# EAGLE design ADJ POS (EAGLE 6.4)
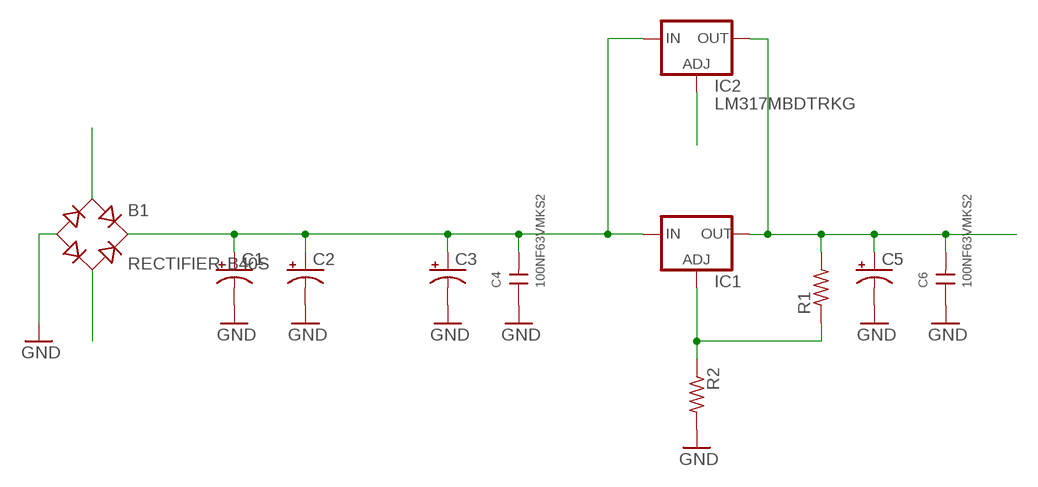
[diagram p0: schematic, sheet 1]

## Parts
B1  RECTIFIER-B40S  [B40S]
C1  CPOL-USE7.5-16  [E7,5-16]
C2  CPOL-USE7.5-16  [E7,5-16]
C3  CPOL-USE2-5  [E2-5]
C4  100NF63VMKS2  [2,5X6,5RM5,0]
C5  CPOL-USE2-5  [E2-5]
C6  100NF63VMKS2  [2,5X6,5RM5,0]
IC1  LM317TS  [317TS]
IC2  LM317MBDTRKG  [DPACK]
R1  R-US_0309/12  [0309/12]
R2  R-US_0309/12  [0309/12]

## Nets
AC_1: B1.AC1
AC_2: B1.AC2
ADJ: IC1.1(ADJ) IC2.1(ADJ) R1.1 R2.1
GND: B1.- C1.- C2.- C3.- C4.1 C5.- C6.1 R2.2
IN: B1.+ C1.+ C2.+ C3.+ C4.2 IC1.3(IN) IC2.3(IN)
OUT: C5.+ C6.2 IC1.2(OUT) IC2.4(OUT) R1.2

## Library data of the parts
B1 = rectifier:RECTIFIER-: Rectifier
C1-C3 C5 = rcl:CPOL-US: POLARIZED CAPACITOR, American symbol
C4 C6 = wima_c:100NF63V
IC1 = v-reg-2:LM317TS: VOLTAGE REGULATOR
IC2 = lasser:LM317?*: 500 mA Adjustable Output Positive Voltage Regulator Source: http://www.onsemi.co.jp .. LM317M-D.PDF
R1 R2 = rcl:R-US_: RESISTOR, American symbol

## Board
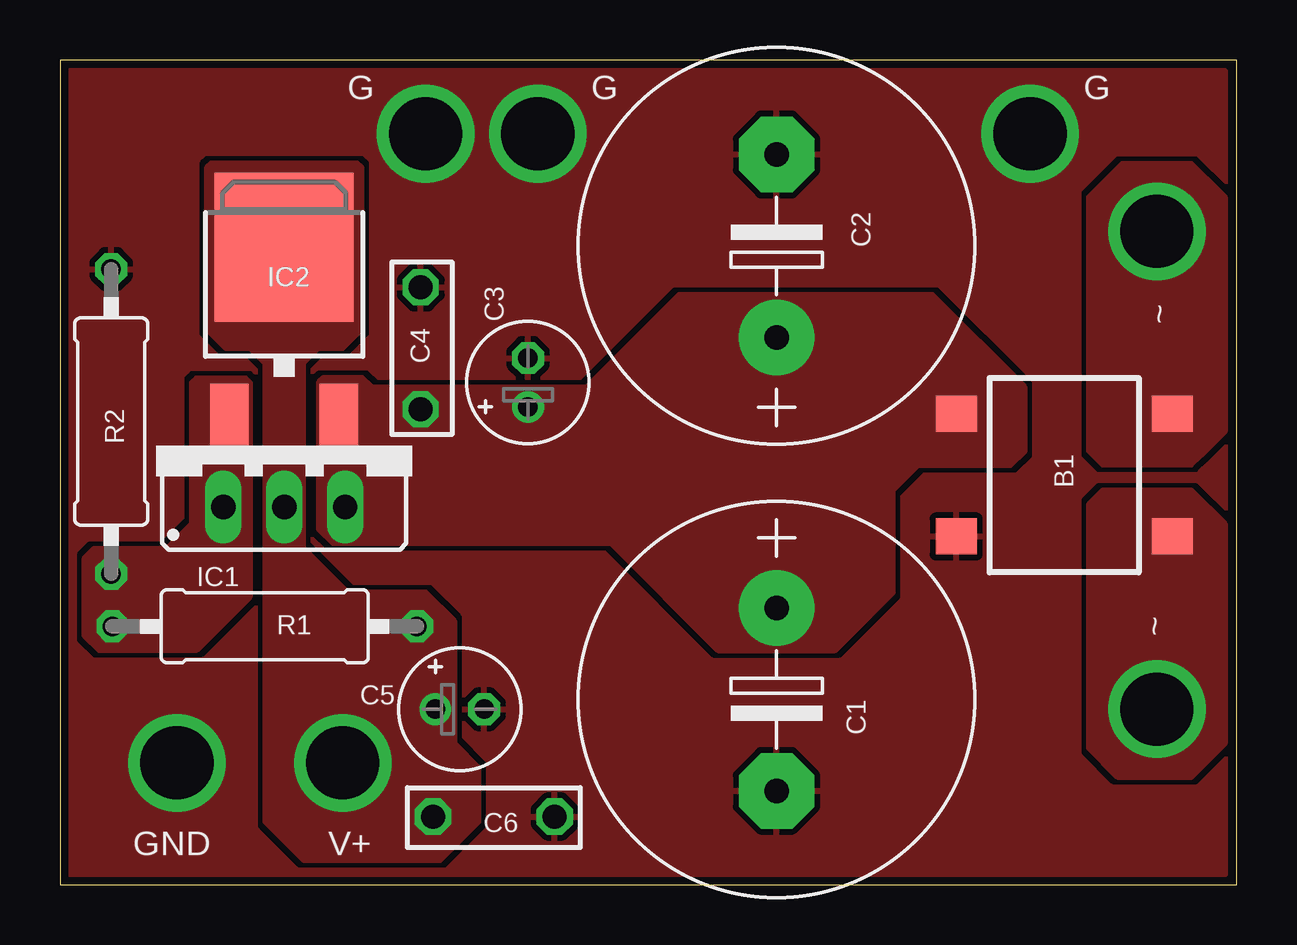
[diagram p1: board, top side]
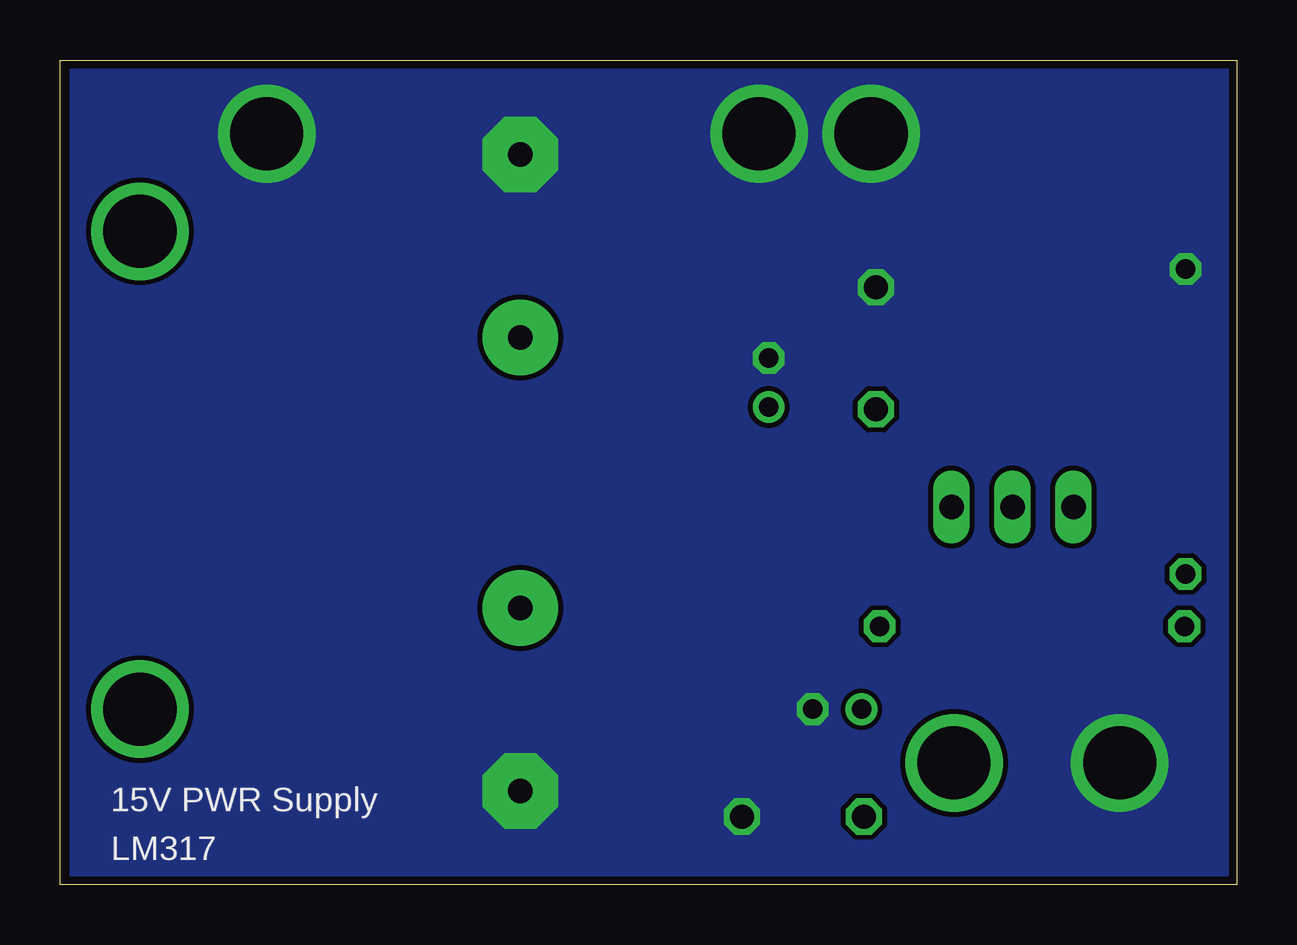
[diagram p2: board, bottom side, seen from below]

Size 49.05 x 34.37 mm. Coordinates in mm from the lower left corner, seen from the top.
Outline: 0,0 49.05,0 49.05,34.37 0,34.37 0,0
Copper layers (1*16): Top 0.035mm / dielectric 1.5mm / Bottom 0.035mm
Design rules "default *": minimum track width 10mil, minimum drill 24mil, track to track 8mil, track to pad 8mil, pad to pad 8mil, via to via 8mil, smd to smd 8mil, copper to edge 13mil, drill to drill 8mil, minimum pad ring 10mil, minimum via ring 8mil, stop-mask expansion 4mil, vias tented up to drill 0mil, thermal gap 10mil

### Footprints (pad centres in the part's own frame; a part is rotated, then mirrored left to right if it is on the bottom)
B40S = smd 1.5 x 1.7: + -2.55,-4.5; - 2.55,-4.5; AC1 -2.55,4.5; AC2 2.55,4.5
E7,5-16 = drill 1.016 pad 3.15: + -3.81,0 | drill 1.016 pad 3.15 octagon: - 3.81,0
E2-5 = drill 0.813 pad 1.27: + -1.016,0 | drill 0.813 pad 1.27 octagon: - 1.016,0
2,5X6,5RM5,0 = drill 1 pad 1.5 octagon: 1 -2.54,0; 2 2.54,0
317TS = drill 1.016 long: 1 -2.54,-2.54; 2 0,-2.54; 3 2.54,-2.54
DPACK = smd 1.6 x 3: 1 -2.28,-4.8; 3 2.28,-4.8 | smd 5.8 x 6.2: 4 0,2.38
0309/12 = drill 0.813 octagon: 1 -6.35,0; 2 6.35,0

### Placement (x,y rotation side)
B1  41.86,17.07 270 top
C1  29.87,7.72 270 top
C2  29.87,26.62 90 top
C3  19.51,20.93 90 top
C4  15.04,22.35 270 top
C5  16.66,7.32 0 top
C6  18.08,2.84 180 top
IC1  9.35,18.29 0 top
IC2  9.35,24.18 0 top
R1  8.53,10.77 0 top
R2  2.13,19.3 90 top

### Tracks (layer width: path | path; a pad name or v marks a point on that pad's centre or on a via)
AC_1  (via drill 3.05)
  other vias: 45.72,27.23
  pour Top (no thermals): 46.33,30.07 47.14,30.07 48.36,28.85 48.56,28.65 48.56,18.9 47.55,17.88 47.14,17.48 43.48,17.48 42.88,18.08 42.88,28.65 44.3,30.07
AC_2  (via drill 3.05)
  other vias: 45.72,7.32
  pour Top (no thermals): 43.48,16.46 47.14,16.46 48.56,15.04 48.56,5.89 47.14,4.47 44.09,4.47 42.88,5.69 42.88,15.85
ADJ
  pour Top (no thermals): 7.72,21.13 7.92,20.93 7.92,11.99 5.69,9.75 1.63,9.75 1.02,10.36 1.02,13.61 1.42,14.02 4.47,14.02 5.49,15.04 5.49,20.93 5.69,21.13
GND  (via drill 3.05)
  other vias: 4.88,5.08 15.24,31.29 19.91,31.29 40.44,31.29
  pour Bottom (no thermals): 0.41,33.93 48.56,33.93 48.56,0.41 0.41,0.41
  pour Top (rank 6): 0.41,33.93 48.56,33.93 48.56,0.41 0.41,0.41
IN
  pour Top (no thermals): 40.23,19.51 40.23,20.73 36.37,24.59 25.81,24.59 21.95,20.73 13,20.73 12.6,21.13 10.97,21.13 10.77,20.93 10.77,14.83 11.38,14.22 22.96,14.22 27.43,9.75 32.31,9.75 34.75,12.19 34.75,16.46 35.76,17.48 39.62,17.48 40.23,18.08
OUT  (via drill 3.05)
  other vias: 11.79,5.08
  pour Top (no thermals): 8.94,14.22 9.75,14.22 10.16,14.63 10.16,21.74 10.77,22.35 11.79,22.35 12.6,23.16 12.6,29.87 12.4,30.07 6.3,30.07 6.1,29.87 6.1,23.16 6.91,22.35 7.92,22.35 8.53,21.74 8.53,14.63
  pour Top (no thermals): 8.53,17.68 8.53,2.64 10.16,1.02 15.85,1.02 17.48,2.64 17.48,4.88 16.46,5.89 16.46,10.97 15.24,12.19 11.99,12.19 10.16,14.02 10.16,17.68

### Text on the board
tPlace: G | G | G | ~ | ~ | GND | V+
bPlace: 15V PWR Supply | LM317